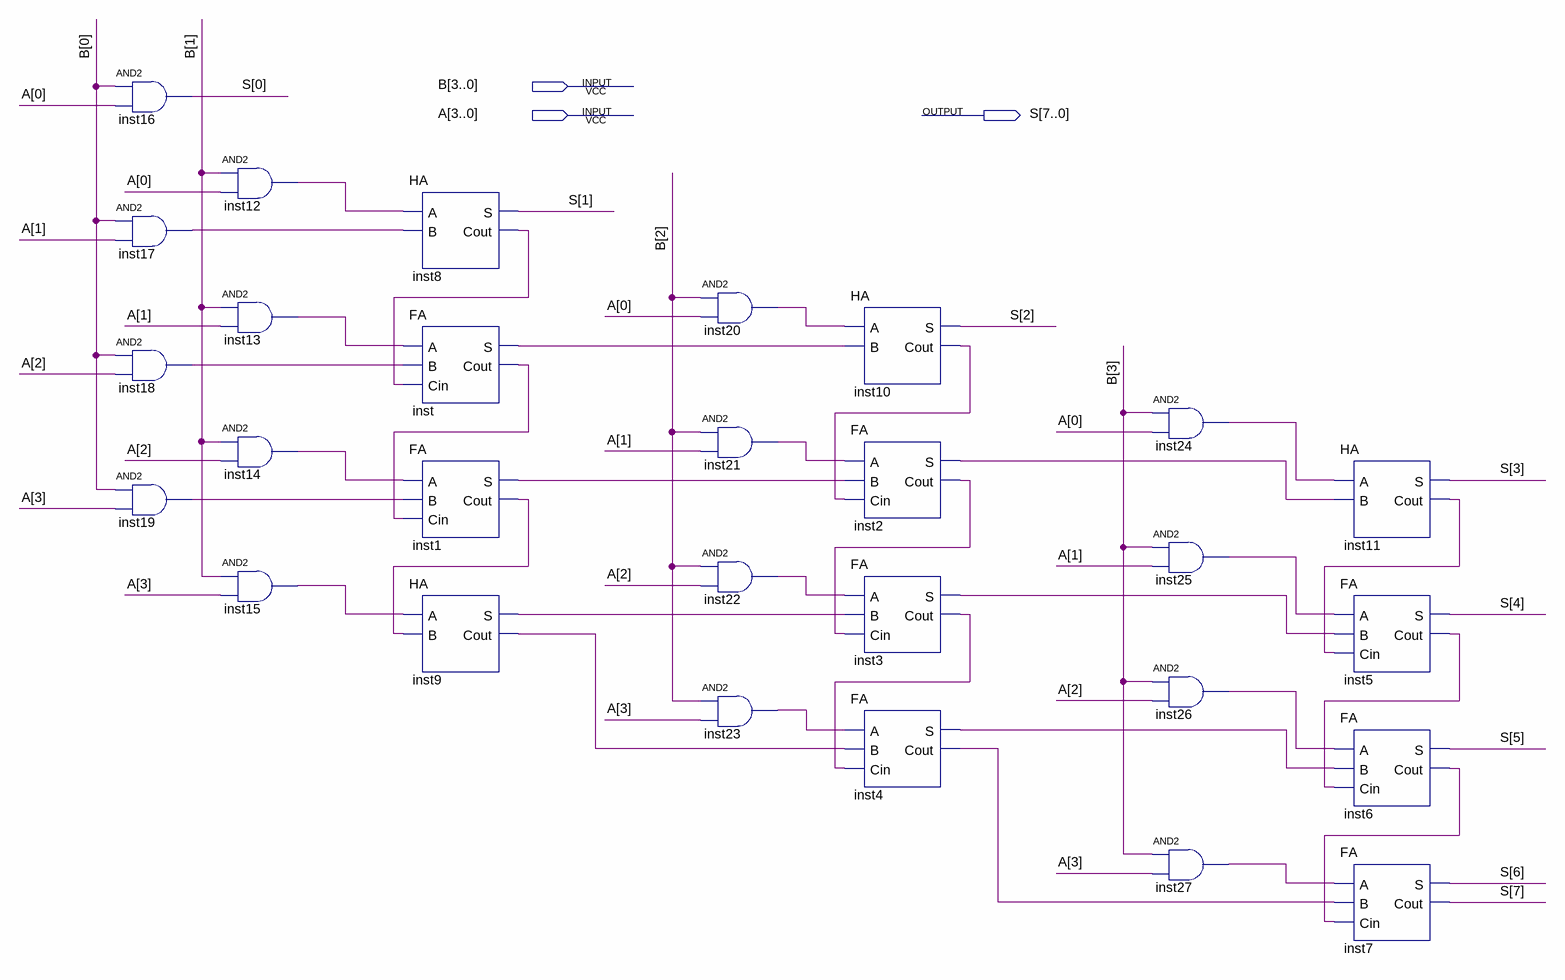
[diagram p0: schematic sheet]
// Quartus schematic Multiplier.bdf as structural Verilog: 28 symbols, 3 pins
module Multiplier (
  input  [3:0] B,
  input  [3:0] A,
  output [7:0] S
);

  wire inst1_cout, inst1_s, inst2_cout, inst2_s, inst3_cout, inst3_s, inst4_cout, inst4_s, inst5_cout,
       inst6_cout, inst8_cout, inst9_cout, inst9_s, inst10_cout, inst11_cout, inst12_out, inst13_out,
       inst14_out, inst15_out, inst17_out, inst18_out, inst19_out, inst20_out, inst21_out, inst22_out,
       inst23_out, inst24_out, inst25_out, inst26_out, inst27_out, inst_cout, inst_s;

  and inst16 (S[0], B[0], A[0]);
  and inst17 (inst17_out, B[0], A[1]);
  and inst18 (inst18_out, B[0], A[2]);
  and inst19 (inst19_out, B[0], A[3]);
  and inst12 (inst12_out, B[1], A[0]);
  and inst13 (inst13_out, B[1], A[1]);
  and inst14 (inst14_out, B[1], A[2]);
  and inst15 (inst15_out, B[1], A[3]);
  HA inst8 (.A(inst12_out), .B(inst17_out), .S(S[1]), .Cout(inst8_cout));
  FA inst (.A(inst13_out), .B(inst18_out), .Cin(inst8_cout), .S(inst_s), .Cout(inst_cout));
  FA inst1 (.A(inst14_out), .B(inst19_out), .Cin(inst_cout), .S(inst1_s), .Cout(inst1_cout));
  HA inst9 (.A(inst15_out), .B(inst1_cout), .S(inst9_s), .Cout(inst9_cout));
  and inst20 (inst20_out, B[2], A[0]);
  and inst21 (inst21_out, B[2], A[1]);
  and inst22 (inst22_out, B[2], A[2]);
  and inst23 (inst23_out, B[2], A[3]);
  HA inst10 (.A(inst20_out), .B(inst_s), .S(S[2]), .Cout(inst10_cout));
  FA inst2 (.A(inst21_out), .B(inst1_s), .Cin(inst10_cout), .S(inst2_s), .Cout(inst2_cout));
  FA inst3 (.A(inst22_out), .B(inst9_s), .Cin(inst2_cout), .S(inst3_s), .Cout(inst3_cout));
  FA inst4 (.A(inst23_out), .B(inst9_cout), .Cin(inst3_cout), .S(inst4_s), .Cout(inst4_cout));
  and inst24 (inst24_out, B[3], A[0]);
  and inst25 (inst25_out, B[3], A[1]);
  and inst26 (inst26_out, B[3], A[2]);
  and inst27 (inst27_out, B[3], A[3]);
  HA inst11 (.A(inst24_out), .B(inst2_s), .S(S[3]), .Cout(inst11_cout));
  FA inst5 (.A(inst25_out), .B(inst3_s), .Cin(inst11_cout), .S(S[4]), .Cout(inst5_cout));
  FA inst6 (.A(inst26_out), .B(inst4_s), .Cin(inst5_cout), .S(S[5]), .Cout(inst6_cout));
  FA inst7 (.A(inst27_out), .B(inst4_cout), .Cin(inst6_cout), .S(S[6]), .Cout(S[7]));
endmodule
